# EAGLE design approg (EAGLE 6.4)
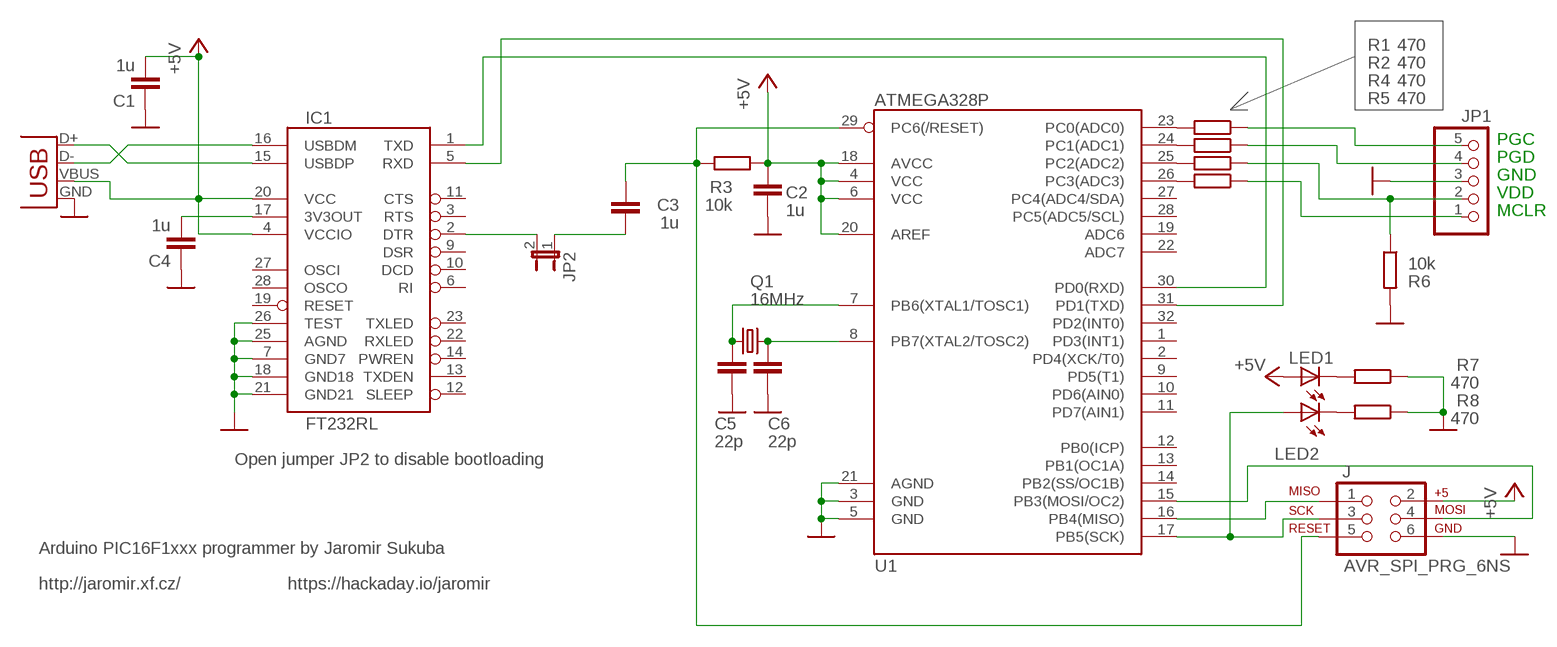
[diagram p0: schematic, sheet 1]

## Parts
C1  1u  C_0806  [R0805]
C2  1u  C_0806  [R0805]
C3  1u  C_0806  [R0805]
C4  1u  C_0806  [R0805]
C5  22p  C_0806  [R0805]
C6  22p  C_0806  [R0805]
IC1  FT232RL  FT232RLSSOP  [SSOP28DB]
J  AVR_SPI_PRG_6NS  [2X3-NS]
JP1  PINHD-1X5/90  [1X05/90]
JP2  JP1E  [JP1]
LED1  LEDCHIPLED_0805  [CHIPLED_0805]
LED2  LEDCHIPLED_0805  [CHIPLED_0805]
Q1  16MHz  CRYSTALHC49S  [HC49/S]
R1  470  R_0805  [R0805]
R2  470  R_0805  [R0805]
R3  10k  R_0805  [R0805]
R4  470  R_0805  [R0805]
R5  470  R_0805  [R0805]
R6  10k  R_0805  [R0805]
R7  470  R_0805  [R0805]
R8  470  R_0805  [R0805]
U1  ATMEGA328P  ATMEGA328_SMT  [TQFP32-08]
X1  USB-MICROB  [USB-MICROB]

## Nets
3V3: C4.2 IC1.17(3V3OUT)
+5V: C1.2 C2.1 IC1.4(VCCIO) IC1.20(VCC) J.2 LED1.A R3.1 U1.4(VCC) U1.6(VCC) U1.18(AVCC) U1.20(AREF) X1.VBUS
GND: C1.1 C2.2 C4.1 C5.2 C6.2 IC1.7(GND7) IC1.18(GND18) IC1.21(GND21) IC1.25(AGND) IC1.26(TEST) J.6 JP1.3 R6.2 R7.1 R8.1 U1.3(GND) U1.5(GND) U1.21(AGND) X1.GND
N$1: IC1.2(DTR) JP2.2
N$5: C5.1 Q1.1 U1.7(PB6(XTAL1/TOSC1))
N$6: C6.1 Q1.2 U1.8(PB7(XTAL2/TOSC2))
N$7: C3.2 JP2.1
N$8: C3.1 J.5 R3.2 U1.29(PC6(/RESET))
N$10: JP1.1 R5.1
N$12: IC1.16(USBDM) X1.D-
N$13: J.1 U1.16(PB4(MISO))
N$14: J.4 U1.15(PB3(MOSI/OC2))
N$15: LED2.C R8.2
N$16: LED1.C R7.2
N$17: J.3 LED2.A U1.17(PB5(SCK))
N$18: JP1.5 R1.1
N$19: JP1.4 R2.1
N$20: JP1.2 R4.1 R6.1
N$21: R1.2 U1.23(PC0(ADC0))
N$22: R2.2 U1.24(PC1(ADC1))
N$23: R4.2 U1.25(PC2(ADC2))
N$24: R5.2 U1.26(PC3(ADC3))
N$25: IC1.15(USBDP) X1.D+
U_RX: IC1.5(RXD) U1.31(PD1(TXD))
U_TX: IC1.1(TXD) U1.30(PD0(RXD))
Unconnected: IC1.3(RTS) IC1.6(RI) IC1.9(DSR) IC1.10(DCD) IC1.11(CTS) IC1.12(SLEEP) IC1.13(TXDEN) IC1.14(PWREN) IC1.19(RESET) IC1.22(RXLED) IC1.23(TXLED) IC1.27(OSCI) IC1.28(OSCO) U1.1(PD3(INT1)) U1.2(PD4(XCK/T0)) U1.9(PD5(T1)) U1.10(PD6(AIN0)) U1.11(PD7(AIN1)) U1.12(PB0(ICP)) U1.13(PB1(OC1A)) U1.14(PB2(SS/OC1B)) U1.19(ADC6) U1.22(ADC7) U1.27(PC4(ADC4/SDA)) U1.28(PC5(ADC5/SCL)) U1.32(PD2(INT0))

## Notes on the sheet
- PGC
- PGD
- GND
- VDD
- MCLR
- Open jumper JP2 to disable bootloading
- Arduino PIC16F1xxx programmer by Jaromir Sukuba
- http://jaromir.xf.cz/ | https://hackaday.io/jaromir

## Library data of the parts
C1-C6 = _moja:C
IC1 = SparkFun:FT232RL: USB UART FT232RL 4th Generation USB UART (USB <-> Serial) Controller. Spark Fun Electronics SKU : COM-00650
J = SparkFun:AVR_SPI_PRG_6: AVR ISP 6 Pin This is the reduced ISP connector for AVR programming. Common on Arduino. This footprint will take up less PCB space and can be used with a 10-pin to 6-pin adapter such as SKU: BOB-08508
JP1 = pinhead:PINHD-1X5: PIN HEADER
JP2 = jumper:JP1E: JUMPER
LED1 LED2 = led:LED: LED OSRAM: - CHIPLED LG R971, LG N971, LY N971, LG Q971, LY Q971, LO R971, LY R971 LH N974, LH R974 LS Q976, LO Q976, LY Q976 LO Q996 - Hyper CHIPLED LW Q18S LB Q993, LB Q99A, LB R99A - SideLED LS A670, LO A670, LY A670, LG A670, LP A670 LB A673, LV A673, LT A673, LW A673 LH A674 LY A675 LS A676, LA A676, LO A676, LY A676, LW A676 LS A679, LY A679, LG A679 - Hyper Micro SIDELED® LS Y876, LA Y876, LO Y876, LY Y876 LT Y87S - SmartLED LW L88C, LW L88S LB L89C, LB L89S, LG L890 LS L89K, LO L89K, LY L89K LS L896, LA L896, LO L896, LY L896 - TOPLED LS T670, LO T670, LY T670, LG T670, LP T670 LSG T670, LSP T670, LSY T670, LOP T670, LYG T670 LG T671, LOG T671, LSG T671 LB T673, LV T673, LT T673, LW T673 LH T674 LS T676, LA T676, LO T676, LY T676, LB T676, LH T676, LSB T676, LW T676 LB T67C, LV T67C, LT T67C, LS T67K, LO T67K, LY T67K, LW E67C LS E67B, LA E67B, LO E67B, LY E67B, LB E67C, LV E67C, LT E67C LW T67C LS T679, LY T679, LG T679 LS T770, LO T770, LY T770, LG T770, LP T770 LB T773, LV T773, LT T773, LW T773 LH T774 LS E675, LA E675, LY E675, LS T675 LS T776, LA T776, LO T776, LY T776, LB T776 LHGB T686 LT T68C, LB T68C - Hyper Mini TOPLED® LB M676 - Mini TOPLED Santana® LG M470 LS M47K, LO M47K, LY M47K Source: http://www.osram.convergy.de LUXEON: - LUMILED® LXK2-PW12-R00, LXK2-PW12-S00, LXK2-PW14-U00, LXK2-PW14-V00 LXK2-PM12-R00, LXK2-PM12-S00, LXK2-PM14-U00 LXK2-PE12-Q00, LXK2-PE12-R00, LXK2-PE12-S00, LXK2-PE14-T00, LXK2-PE14-U00 LXK2-PB12-K00, LXK2-PB12-L00, LXK2-PB12-M00, LXK2-PB14-N00, LXK2-PB14-P00, LXK2-PB14-Q00 LXK2-PR12-L00, LXK2-PR12-M00, LXK2-PR14-Q00, LXK2-PR14-R00 LXK2-PD12-Q00, LXK2-PD12-R00, LXK2-PD12-S00 LXK2-PH12-R00, LXK2-PH12-S00 LXK2-PL12-P00, LXK2-PL12-Q00, LXK2-PL12-R00 Source: www.luxeon.com KINGBRIGHT: KA-3528ASYC Source: www.kingbright.com
Q1 = crystal:CRYSTAL: CRYSTAL
R1-R8 = _moja:R
U1 = SparkFun-DigitalIC:ATMEGA328_SMT: 32-Pin Atmega328 part Commonly used on Arduino compatible boards Available in QFP and QFN packages TQFP is IC-09069 QFN is non-stock; PROD_ID: IC-09069
X1 = SparkFun:USB: USB Connectors USB-B-PTH is fully proven SKU : PRT-00139 USB-miniB is fully proven SKU : PRT-00587 USB-A-PCB is untested. USB-A-H is throughly reviewed, but untested. Spark Fun Electronics SKU : PRT-00437 USB-B-SMT is throughly reviewed, but untested. Needs silkscreen touching up. USB-A-S has not been used/tested USB-MB-H has not been used/tested

## Board
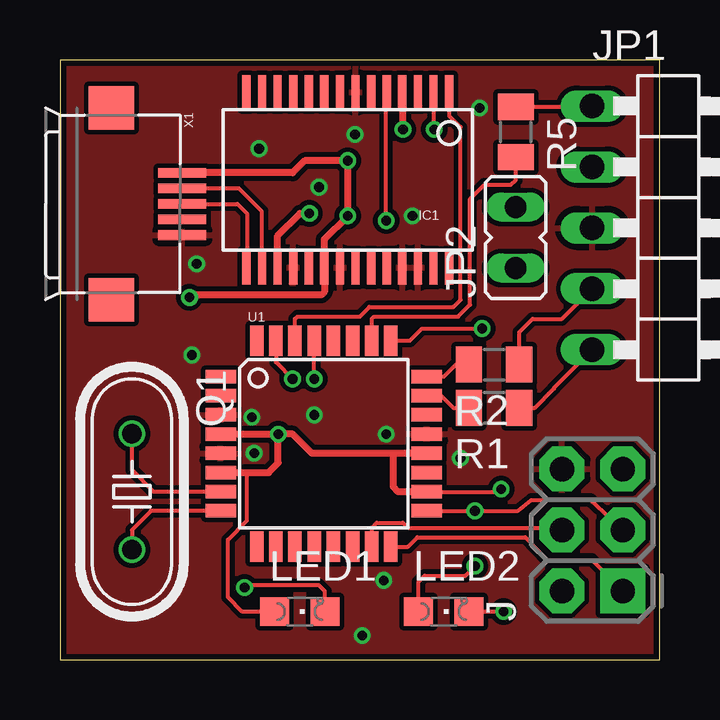
[diagram p1: board, top side]
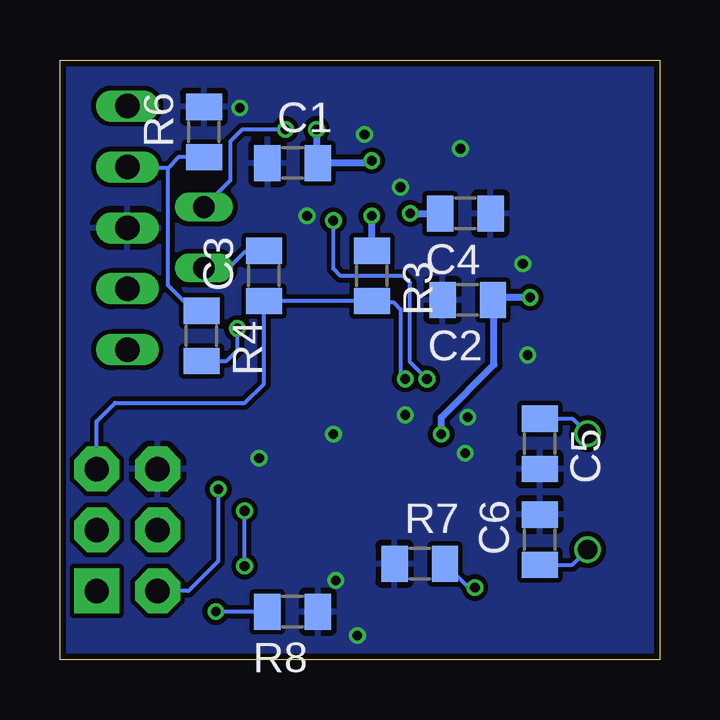
[diagram p2: board, bottom side, seen from below]

Size 25 x 25 mm. Coordinates in mm from the lower left corner, seen from the top.
Outline: 0,0 25,0 25,25 0,25 0,0
Copper layers (1*16): Top 0.035mm / dielectric 1.5mm / Bottom 0.035mm
Design rules "ch_6": minimum track width 0.15mm, minimum drill 0.4mm, track to track 0.2mm, track to pad 0.2mm, pad to pad 0.2mm, via to via 0.2mm, smd to smd 0.2mm, copper to edge 10mil, drill to drill 8mil, minimum pad ring 0.15mm, minimum via ring 0.15mm, stop-mask expansion 4mil, vias tented up to drill 0mil, thermal gap 10mil

### Footprints (pad centres in the part's own frame; a part is rotated, then mirrored left to right if it is on the bottom)
R0805 = smd 1.1 x 1.5: 1 -1.05,0; 2 1.05,0
SSOP28DB = smd 0.348 x 1.397: 1 -4.225,-3.656; 2 -3.575,-3.656; 3 -2.925,-3.656; 4 -2.275,-3.656; 5 -1.625,-3.656; 6 -0.975,-3.656; 7 -0.325,-3.656; 8 0.325,-3.656; 9 0.975,-3.656; 10 1.625,-3.656; 11 2.275,-3.656; 12 2.925,-3.656; 13 3.575,-3.656; 14 4.225,-3.656; 15 4.225,3.656; 16 3.575,3.656; 17 2.925,3.656; 18 2.275,3.656; 19 1.625,3.656; 20 0.975,3.656; 21 0.325,3.656; 22 -0.325,3.656; 23 -0.975,3.656; 24 -1.625,3.656; 25 -2.275,3.656; 26 -2.925,3.656; 27 -3.575,3.656; 28 -4.225,3.656
2X3-NS = drill 1.016 pad 1.88 square: 1 -2.54,-1.27 | drill 1.016 pad 1.88 octagon: 2 -2.54,1.27; 3 0,-1.27; 4 0,1.27; 5 2.54,-1.27; 6 2.54,1.27
1X05/90 = drill 1.016 long: 1 -5.08,-3.81; 2 -2.54,-3.81; 3 0,-3.81; 4 2.54,-3.81; 5 5.08,-3.81
JP1 = drill 0.914 long: 1 0,-1.27; 2 0,1.27
CHIPLED_0805 = smd 1.2 x 1.2: A 0,-1.05; C 0,1.05
HC49/S = drill 0.813: 1 -2.413,0; 2 2.413,0
TQFP32-08 = smd 1.27 x 0.559: 1 -4.293,2.8; 2 -4.293,2; 3 -4.293,1.2; 4 -4.293,0.4; 5 -4.293,-0.4; 6 -4.293,-1.2; 7 -4.293,-2; 8 -4.293,-2.8; 17 4.293,-2.8; 18 4.293,-2; 19 4.293,-1.2; 20 4.293,-0.4; 21 4.293,0.4; 22 4.293,1.2; 23 4.293,2; 24 4.293,2.8 | smd 0.559 x 1.27: 9 -2.8,-4.293; 10 -2,-4.293; 11 -1.2,-4.293; 12 -0.4,-4.293; 13 0.4,-4.293; 14 1.2,-4.293; 15 2,-4.293; 16 2.8,-4.293; 25 2.8,4.293; 26 2,4.293; 27 1.2,4.293; 28 0.4,4.293; 29 -0.4,4.293; 30 -1.2,4.293; 31 -2,4.293; 32 -2.8,4.293
USB-MICROB = smd 0.4 x 2: D+ 0,3.1; D- -0.65,3.1; GND 1.3,3.1; ID 0.65,3.1; VBUS -1.3,3.1 | smd 1.8 x 1.9: GND@2 -4,0.15; GND@3 4,0.15

### Placement (x,y rotation side)
C1  15.3,20.7 0 bottom
C2  8,15 180 bottom
C3  16.5,16 90 bottom
C4  8.1,18.6 180 bottom
C5  5,9 270 bottom
C6  5,5 90 bottom
IC1  12,20 180 top
J  22.2,5.4 90 top
JP1  26,18 270 top
JP2  19,17.6 0 top
LED1  10,2 270 top
LED2  16,2 270 top
Q1  3,7 270 top
R1  18.1,10.5 180 top
R2  18.1,12.3 180 top
R3  12,16 270 bottom
R4  19.1,13.5 270 bottom
R5  19,22 270 top
R6  19,22 90 bottom
R7  10,4 0 bottom
R8  15.3,2 180 bottom
U1  11,9 0 top
X1  2,19 270 top

### Tracks (layer width: path | path; a pad name or v marks a point on that pad's centre or on a via)
3V3  (via drill 0.4)
  Top 0.3: IC1.17 9.07,17.68 10,18.6 v10.4,18.6
  Bottom 0.3: v10.4,18.6 C4.2
+5V  (via drill 0.4)
  Top 0.16: 7.8,7.8 7.8,5.8 7,5 7,2.6 7.6,2 LED1.A | U1.18 18.3,7 v18.4,7.1
  Top 0.3: U1.4 v9.1,9.4 | U1.6 7.8,7.8 8.7,7.8 9.1,8.2 v9.1,9.4 | U1.20 13.8,8.6 | 13.8,8.6 10.5,8.6 9.7,9.4 v9.1,9.4 | U1.18 14.1,7 13.9,7.2 13.9,8.5 13.8,8.6 | v5.4,15.1 5.5,15.2 10.9,15.2 11.03,15.32 IC1.20 11.03,17.52 v12,18.5 v12,20.8 10.2,20.8 9.7,20.3 X1.VBUS | IC1.4 14.28,22.12 v14.3,22.1
  Bottom 0.16: v18.4,7.1 18.4,4.1 19.64,2.86 J.2
  Bottom 0.3: v5.4,15.1 6.85,15.1 C2.1 6.9,14.95 6.9,12.3 9.1,10.1 v9.1,9.4 | v12,20.8 12.1,20.7 C1.2 14.3,20.35 v14.3,22.1 | R3.1 v12,18.5
GND  (via drill 0.4)
  other vias: 13.6,9.4 16.7,8.4 5.5,12.7 8.1,8.6 10.6,10.2 13.5,3.3 12.6,1 8,10.1 10.8,19.7 12.3,21.9 14.7,18.5 17.5,23 5.7,16.5 8.3,21.3
  pour Top: 0,0 25,0 25,25 0,25
  pour Bottom: 0,0 25,0 25,25 0,25
N$1  (via drill 0.4)
  Top 0.16: v15.6,22.1 15.6,23.63 IC1.2
  Bottom 0.16: v15.6,22.1 17.4,22.1 17.9,21.6 17.9,19.97 JP2.2
N$5
  Top 0.16: U1.7 3.9,7 3,7.9 Q1.1
  Bottom 0.16: C5.1 3.64,10.05 Q1.1
N$6
  Top 0.16: U1.8 3.8,6.2 3,5.4 Q1.2
  Bottom 0.16: C6.1 3.64,3.95 Q1.2
N$7
  Bottom 0.16: JP2.1 17.97,16.33 17.3,17 16.05,17 C3.2
N$8  (via drill 0.4)
  Top 0.16: v10.6,11.7 U1.29
  Bottom 0.16: J.5 23.47,9.93 22.7,10.7 17.3,10.7 16.5,11.5 C3.1 R3.2 11.95,14.9 11.1,14.9 10.8,14.6 10.8,11.9 v10.6,11.7
N$10
  Top 0.16: R5.1 22.16,23.05 JP1.1
N$12
  Top 0.16: X1.D- 7.45,19.65 8.4,18.7 8.4,16.37 IC1.16
N$13
  Top 0.16: J.1 22.18,4.15 20.3,4.15 19.4,5.1 14.9,5.1 14.51,4.71 U1.16
N$14
  Top 0.16: U1.15 13,5.5 13.2,5.7 14.3,5.7 14.5,5.5 20.8,5.5 J.4
N$15  (via drill 0.4)
  Top 0.16: v18.5,2 LED2.C
  Bottom 0.16: R8.2 v18.5,2
N$16  (via drill 0.4)
  Top 0.16: LED1.C 11.05,2.85 10.8,3.1 7.8,3.1 v7.7,3
  Bottom 0.16: v7.7,3 7.95,3 R7.2
N$17  (via drill 0.4)
  Top 0.16: U1.17 v17.3,6.2 19.1,6.2 19.65,6.65 22.12,6.65 J.3 | LED2.A 14.95,3.25 15.2,3.5 16.9,3.5 v17.3,3.9
  Bottom 0.16: v17.3,3.9 v17.3,6.2
N$18
  Top 0.16: R1.1 19.8,10.5 20.6,11.3 20.6,11.33 JP1.5
N$19
  Top 0.16: R2.1 19.15,13.65 19.7,14.2 20.93,14.2 JP1.4
N$20
  Bottom 0.16: R6.1 20.05,20.95 20.5,20.5 | 20.5,20.5 22.15,20.5 JP1.2 | R4.1 19.85,14.95 20.5,15.6 20.5,20.5
N$21
  Top 0.16: U1.23 15.9,11 16.4,10.5 R1.2
N$22
  Top 0.16: U1.24 16,11.8 16.5,12.3 R2.2
N$23  (via drill 0.4)
  Top 0.16: U1.25 14.59,13.29 15.1,13.8 v17.6,13.8
  Bottom 0.16: R4.2 18.05,12.45 17.6,12.9 v17.6,13.8
N$24
  Top 0.16: U1.26 13,14.2 13.1,14.3 16.6,14.3 17.1,14.8 17.1,19.2 17.7,19.8 18.8,19.8 19,20 R5.2
N$25
  Top 0.16: X1.D+ 7.4,19 7.8,18.6 7.8,16.37 IC1.15
U_RX  (via drill 0.4)
  Top 0.16: U1.31 9,12.4 v9.7,11.7 | v13.6,18.3 13.6,23.63 IC1.5
  Bottom 0.16: v9.7,11.7 10.4,12.4 10.4,15.7 10.7,16 13.3,16 13.6,16.3 v13.6,18.3
U_TX
  Top 0.16: U1.30 9.8,14.2 9.9,14.3 12.5,14.3 12.9,14.7 16.4,14.7 16.7,15 16.7,22.2 16.23,22.68 IC1.1